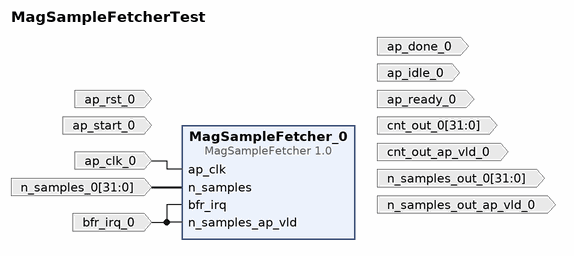
[diagram p0: block diagram of the top level]
# Vivado block design MagSampleFetcherTest, xczu3eg-sbva484-1-i, Vivado 2020.2
create_bd_design MagSampleFetcherTest

create_bd_port -dir I -type clk ap_clk_0
create_bd_port -dir I -type rst ap_rst_0
set_property -dict {CONFIG.POLARITY ACTIVE_HIGH} [get_bd_ports ap_rst_0]
create_bd_port -dir O ap_idle_0
create_bd_port -dir O ap_done_0
create_bd_port -dir I ap_start_0
create_bd_port -dir O ap_ready_0
create_bd_port -dir I -from 31 -to 0 -type data n_samples_0
create_bd_port -dir O cnt_out_ap_vld_0
create_bd_port -dir O -from 31 -to 0 -type data n_samples_out_0
create_bd_port -dir O n_samples_out_ap_vld_0
create_bd_port -dir I -type data bfr_irq_0
create_bd_port -dir O -from 31 -to 0 -type data cnt_out_0

create_bd_cell -type ip -vlnv DIII:PL-Mag-Sensor:MagSampleFetcher:1.0 MagSampleFetcher_0

# ---- connections ----

connect_bd_net -net ap_clk_0_1 [get_bd_ports ap_clk_0] [get_bd_pins MagSampleFetcher_0/ap_clk]
# net ap_rst_0_1 has one end: ap_rst_0
# net MagSampleFetcher_0_ap_idle has one end: ap_idle_0
# net MagSampleFetcher_0_ap_done has one end: ap_done_0
# net ap_start_0_1 has one end: ap_start_0
# net MagSampleFetcher_0_ap_ready has one end: ap_ready_0
connect_bd_net -net n_samples_0_1 [get_bd_ports n_samples_0] [get_bd_pins MagSampleFetcher_0/n_samples]
# net MagSampleFetcher_0_cnt_out_ap_vld has one end: cnt_out_ap_vld_0
# net MagSampleFetcher_0_n_samples_out has one end: n_samples_out_0
# net MagSampleFetcher_0_n_samples_out_ap_vld has one end: n_samples_out_ap_vld_0
# net MagSampleFetcher_0_cnt_out has one end: cnt_out_0
connect_bd_net -net bfr_irq_0_1 [get_bd_ports bfr_irq_0] [get_bd_pins MagSampleFetcher_0/n_samples_ap_vld] [get_bd_pins MagSampleFetcher_0/bfr_irq]

validate_bd_design
save_bd_design
